# EAGLE design Tapuino 1.2 (EAGLE 7.1.0)
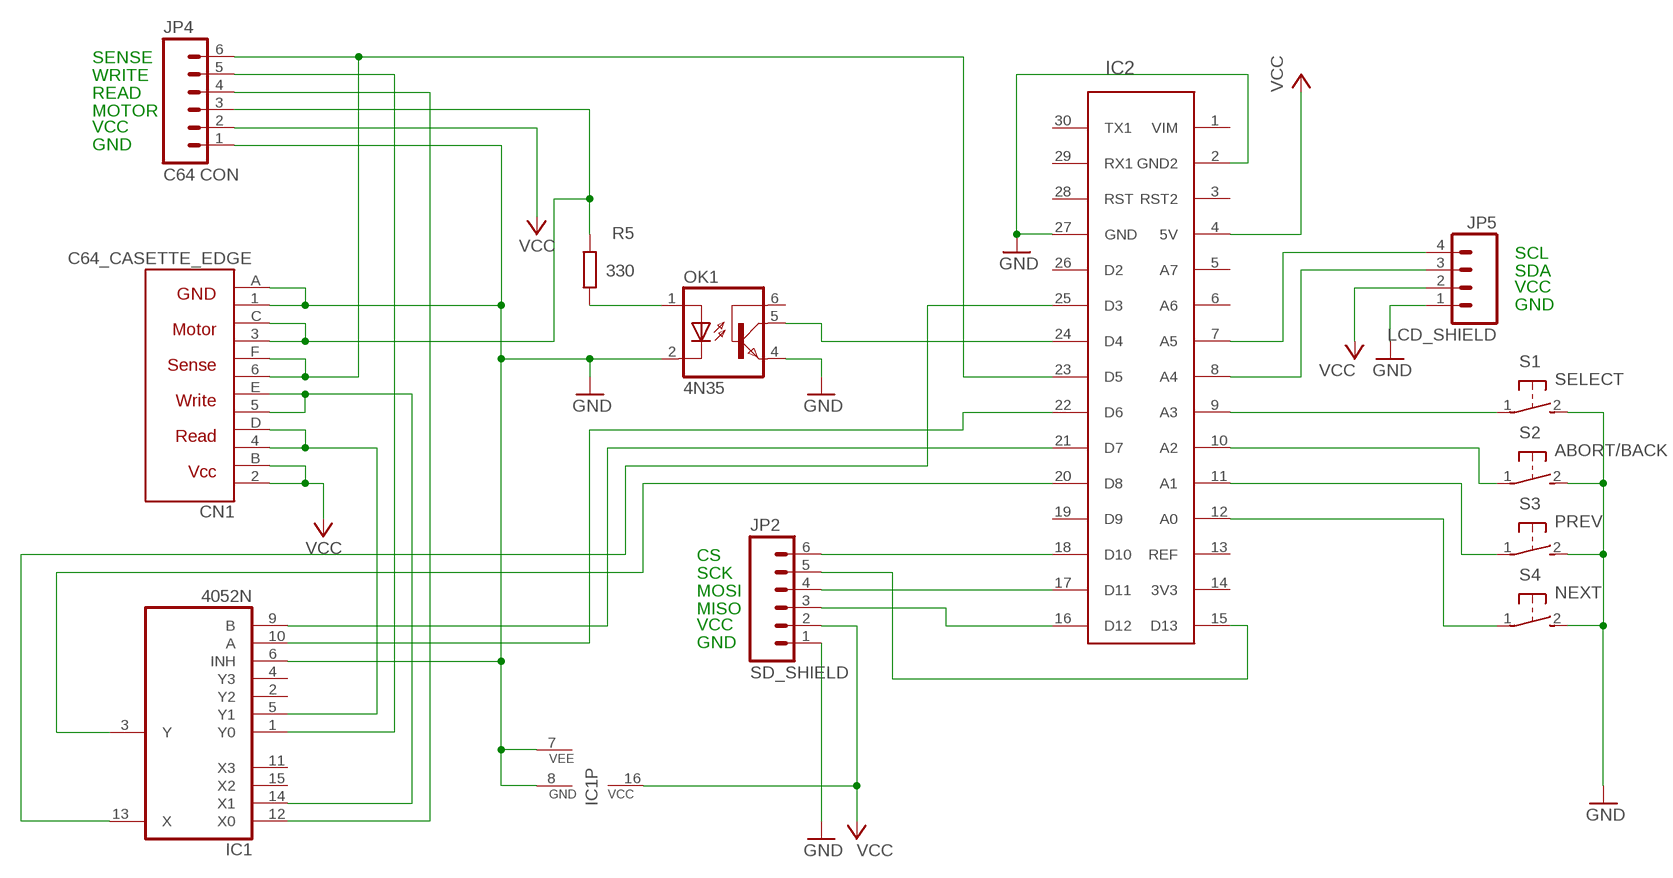
[diagram p0: schematic, sheet 1]

## Parts
CN1  C64_CASETTE_EDGE  [C64_CASSETTE]
IC1  4052N  [DIL16]
IC2  ARDUINO_NANO_V3  [NANO_V3]
JP2  SD_SHIELD  M06LOCK_LONGPADS  [1X06_LOCK_LONGPADS]
JP4  C64 CON  M06LOCK_LONGPADS  [1X06_LOCK_LONGPADS]
JP5  LCD_SHIELD  M04LOCK_LONGPADS  [1X04_LOCK_LONGPADS]
OK1  4N35  [DIL06]
R5  330  R-EU_0207/10  [0207/10]
S1  SELECT  31-XX  [B3F-31XX]
S2  ABORT/BACK  31-XX  [B3F-31XX]
S3  PREV  31-XX  [B3F-31XX]
S4  NEXT  31-XX  [B3F-31XX]

## Nets
GND [GND]: CN1.1(GND1) CN1.A(GND2) IC1.6(INH) IC1.7(VEE) IC1.8(GND) IC2.2(GND2) IC2.27(GND) JP2.1 JP4.1 JP5.1 OK1.2(C) OK1.4(EMI) S1.2(S) S2.2(S) S3.2(S) S4.2(S)
N$1: IC2.16(D12) JP2.3
N$2: IC2.18(D10) JP2.6
N$3: IC2.15(D13) JP2.5
N$4: IC2.17(D11) JP2.4
N$5: IC2.7(A5) JP5.4
N$6: IC2.8(A4) JP5.3
N$7: IC2.9(A3) S1.1(P)
N$8: OK1.1(A) R5.1
N$9: IC2.12(A0) S4.1(P)
N$10: IC2.24(D4) OK1.5(COL)
N$11: IC2.11(A1) S3.1(P)
N$13: IC1.1(Y0) JP4.5
N$14: CN1.3(MOTOR1) CN1.C(MOTOR2) JP4.3 R5.2
N$15: IC1.3(Y) IC2.20(D8)
N$16: IC1.12(X0) JP4.4
N$17: CN1.6(SENSE1) CN1.F(SENSE2) IC2.23(D5) JP4.6
N$18: IC1.13(X) IC2.25(D3)
N$19: CN1.4(READ1) CN1.D(READ2) IC1.5(Y1)
N$20: IC1.9(B) IC2.21(D7)
N$21: CN1.5(WRITE1) CN1.E(WRITE2) IC1.14(X1)
N$22: IC1.10(A) IC2.22(D6)
N$23: IC2.10(A2) S2.1(P)
VCC [VCC]: CN1.2(VCC1) CN1.B(VCC2) IC1.16(VCC) IC2.4(5V) JP2.2 JP4.2 JP5.2
Unconnected: IC1.2(Y2) IC1.4(Y3) IC1.11(X3) IC1.15(X2) IC2.1(VIM) IC2.3(RST2) IC2.5(A7) IC2.6(A6) IC2.13(REF) IC2.14(3V3) IC2.19(D9) IC2.26(D2) IC2.28(RST) IC2.29(RX1) IC2.30(TX1) OK1.6(BAS)

## Notes on the sheet
- SENSE
- WRITE
- READ
- MOTOR
- VCC
- GND
- SCL
- SDA
- VCC
- GND
- CS
- SCK
- MOSI
- MISO
- VCC
- GND

## Library data of the parts
CN1 = commodore:C64_CASETTE_EDGE
IC1 = 40xx:4052: Dual 4-channel ANALOG MULTIPLEXER
IC2 = arduino:ARDUINO_NANO_V3
JP2 JP4 = SparkFun:M06: Header 6 Standard 6-pin 0.1" header. Use with straight break away headers (SKU : PRT-00116), right angle break away headers (PRT-00553), swiss pins (PRT-00743), machine pins (PRT-00117), and female headers (PRT-00115). Molex polarized connector foot print use with SKU : PRT-08094 with associated crimp pins and housings. NOTES ON THE VARIANTS LOCK and LOCK_LONGPADS... This footprint was designed to help hold the alignment of a through-hole component (i.e. 6-pin header) while soldering it into place. You may notice that each hole has been shifted either up or down by 0.005 of an inch from it's more standard position (which is a perfectly straight line). This slight alteration caused the pins (the squares in the middle) to touch the edges of the holes. Because they are alternating, it causes a "brace" to hold the component in place. 0.005 has proven to be the perfect amount of "off-center" position when using our standard breakaway headers. Although looks a little odd when you look at the bare footprint, once you have a header in there, the alteration is very hard to notice. Also, if you push a header all the way into place, it is covered up entirely on the bottom side. This idea of altering the position of holes to aid alignment will be further integrated into the Sparkfun Library for other footprints. It can help hold any component with 3 or more connection pins.
JP5 = SparkFun:M04: Header 4 Standard 4-pin 0.1" header. Use with straight break away headers (SKU : PRT-00116), right angle break away headers (PRT-00553), swiss pins (PRT-00743), machine pins (PRT-00117), and female headers (PRT-00115). Molex polarized connector foot print use with SKU : PRT-08231 with associated crimp pins and housings.
OK1 = optocoupler:4N35: MOTOROLA OPTO COUPLER; MF: FAIRCHILD SEMICONDUCTOR; MPN: 4N35; OC_FARNELL: 1328375; OC_NEWARK: 72K9946
R5 = resistor:R-EU_: RESISTOR, European symbol
S1-S4 = switch-omron:31-XX: OMRON SWITCH; MPN: B3F-3100; OC_FARNELL: 959704; OC_NEWARK: 36M3582

## Net classes
0 default: width 0.254 mm, clearance 0.254 mm
1 GND: width 0.762 mm, clearance 0.381 mm
2 VCC: width 0.762 mm, clearance 0.381 mm

## Board
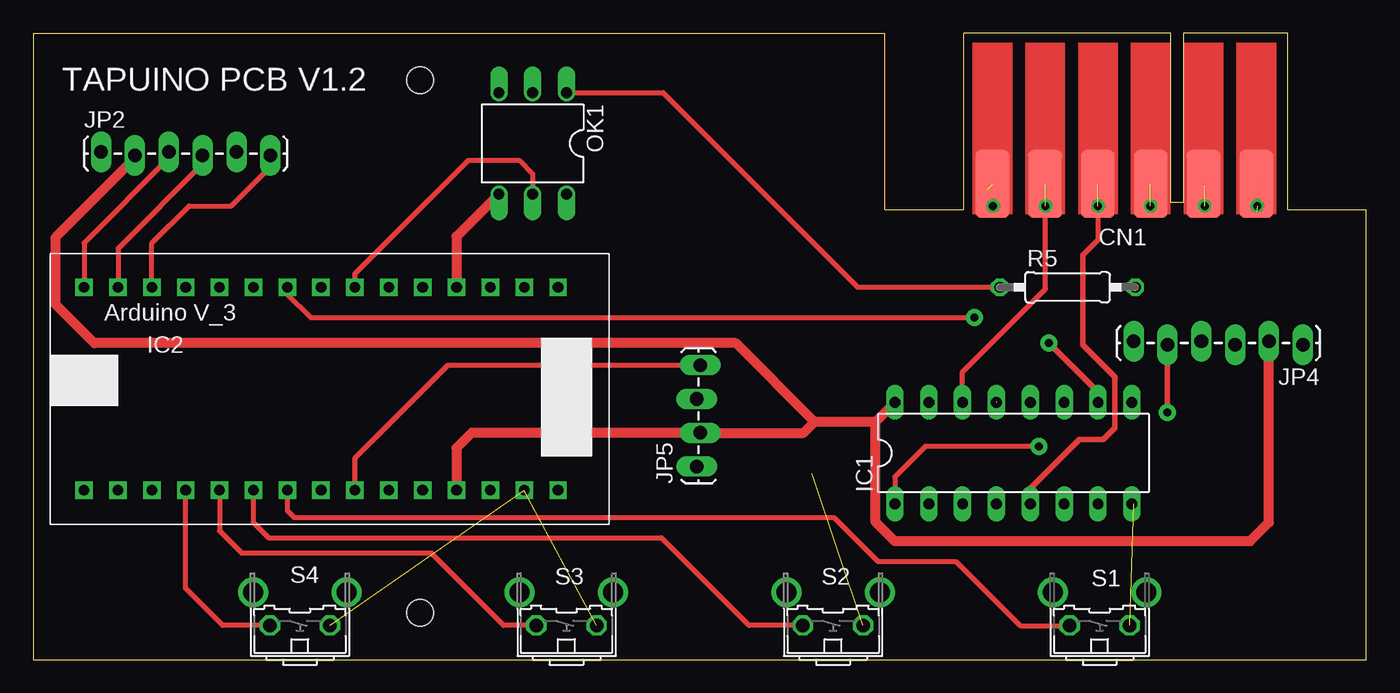
[diagram p1: board, top side]
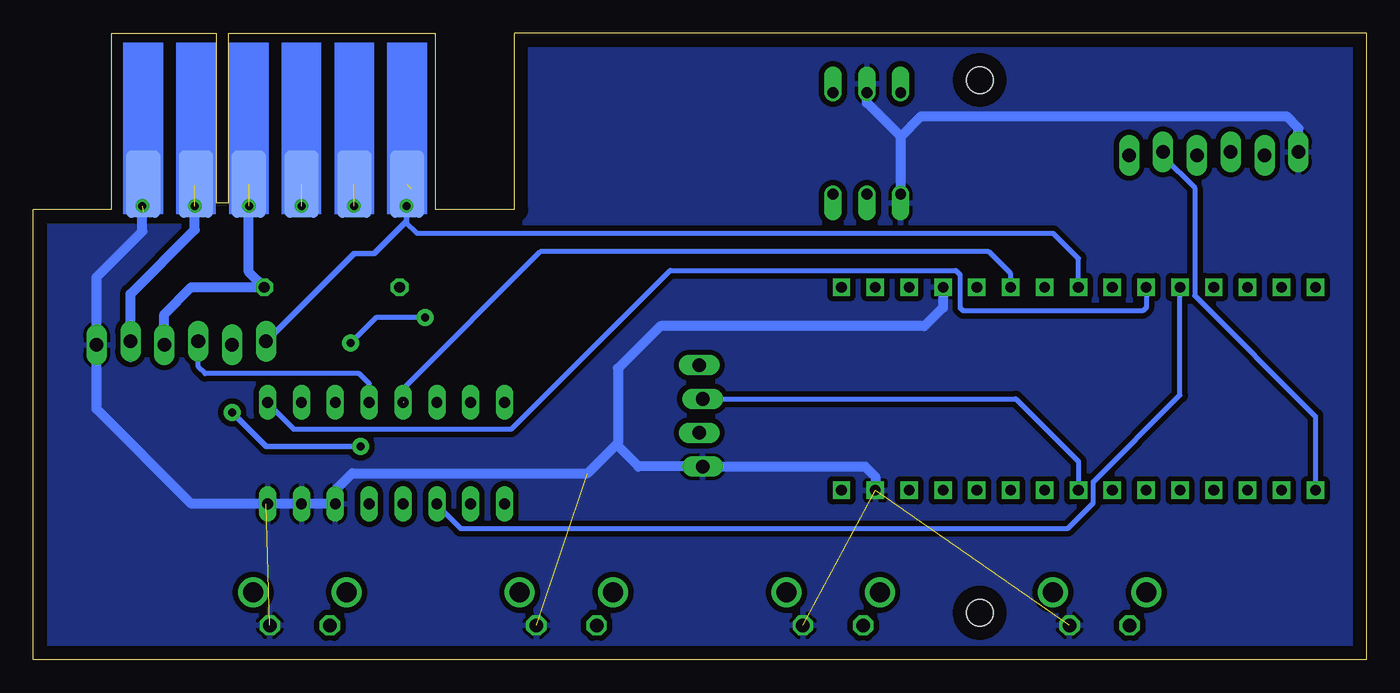
[diagram p2: board, bottom side, seen from below]

Size 100 x 47 mm. Coordinates in mm from the lower left corner, seen from the top.
Outline: 94.11,33.78 100,33.78 100,0 0,0 0,47 63.9,47
Outline: 69.77,33.78 63.88,33.78 63.88,47
Copper layers (1*16): Top 0.035mm / dielectric 1.5mm / Bottom 0.035mm
Design rules "default *": minimum track width 15mil, minimum drill 20mil, track to track 10mil, track to pad 10mil, pad to pad 10mil, via to via 10mil, smd to smd 8mil, copper to edge 40mil, drill to drill 10mil, minimum pad ring 10mil, minimum via ring 8mil, stop-mask expansion 4mil, vias tented up to drill 0mil, thermal gap 10mil
Holes 2 mm at 29,43.5 29,3.5

### Footprints (pad centres in the part's own frame; a part is rotated, then mirrored left to right if it is on the bottom)
C64_CASSETTE = smd 2.54 x 5.08: 1 -21.779,3.68; 2 -17.819,3.68; 3 -13.859,3.68; 4 -9.899,3.68; 5 -5.939,3.68; 6 -1.979,3.68 | smd 2.54 x 5.08 bottom: A -21.779,3.68; B -17.819,3.68; C -13.859,3.68; D -9.899,3.68; E -5.939,3.68; F -1.979,3.68
DIL16 = drill 0.813 long: 1 -8.89,-3.81; 2 -6.35,-3.81; 3 -3.81,-3.81; 4 -1.27,-3.81; 5 1.27,-3.81; 6 3.81,-3.81; 7 6.35,-3.81; 8 8.89,-3.81; 9 8.89,3.81; 10 6.35,3.81; 11 3.81,3.81; 12 1.27,3.81; 13 -1.27,3.81; 14 -3.81,3.81; 15 -6.35,3.81; 16 -8.89,3.81
NANO_V3 = drill 0.8 square: 1 -7.62,1.27; 2 -5.08,1.27; 3 -2.54,1.27; 4 0,1.27; 5 2.54,1.27; 6 5.08,1.27; 7 7.62,1.27; 8 10.16,1.27; 9 12.7,1.27; 10 15.24,1.27; 11 17.78,1.27; 12 20.32,1.27; 13 22.86,1.27; 14 25.4,1.27; 15 27.94,1.27; 16 27.94,-13.97; 17 25.4,-13.97; 18 22.86,-13.97; 19 20.32,-13.97; 20 17.78,-13.97; 21 15.24,-13.97; 22 12.7,-13.97; 23 10.16,-13.97; 24 7.62,-13.97; 25 5.08,-13.97; 26 2.54,-13.97; 27 0,-13.97; 28 -2.54,-13.97; 29 -5.08,-13.97; 30 -7.62,-13.97
1X06_LOCK_LONGPADS = drill 1.016 long: 1 0,0; 2 2.54,-0.254; 3 5.08,0; 4 7.62,-0.254; 5 10.16,0; 6 12.7,-0.254
1X04_LOCK_LONGPADS = drill 1.016 long: 1 0,0; 2 2.54,-0.254; 3 5.08,0; 4 7.62,-0.254
DIL06 = drill 0.813 offset: 1 -2.54,-3.81; 2 0,-3.81; 3 2.54,-3.81; 4 2.54,3.81; 5 0,3.81; 6 -2.54,3.81
0207/10 = drill 0.813 octagon: 1 -5.08,0; 2 5.08,0
B3F-31XX = drill 1.016 octagon: 1 -2.261,-1.245; 2 2.261,-1.245 | drill 1.499 pad 2.159: 3 -3.505,1.245; 4 3.505,1.245

### Placement (x,y rotation side)
CN1  69.98,39.37 180 top
IC1  73.53,15.49 0 top
IC2  31.75,13.97 180 top
JP2  5.08,38.1 0 top
JP4  95.25,23.62 180 top
JP5  49.78,14.48 90 top
OK1  37.47,38.73 180 top
R5  77.6,27.94 0 top
S1  80,3.81 0 top
S2  60,3.81 0 top
S3  40,3.81 0 top
S4  20,3.81 0 top

### Tracks (layer width: path | path; a pad name or v marks a point on that pad's centre or on a via)
GND  (via drill 0.6)  (6 unrouted)
  Top 0.762: IC2.27 31.75,31.75 OK1.4
  Bottom 0.762: JP2.1 5.08,39.88 5.97,40.77 33.4,40.77 34.92,39.24 | IC2.2 36.83,13.72 37.59,14.48 JP5.1 54.61,14.48 56.26,16.13 | IC2.27 31.75,26.42 33.15,25.02 52.96,25.02 56.13,21.84 56.13,16.26 56.26,16.13 | 56.26,16.13 58.42,13.97 76.07,13.97 77.34,12.7 IC1.6 IC1.7 80.01,11.75 80.01,11.68 IC1.8 82.55,11.75 82.55,11.68 88.14,11.68 95.25,18.8 JP4.1 95.25,28.7 91.82,32.13 91.82,33.53 91.76,33.59 | OK1.4 34.92,39.24 | 34.92,39.24 37.47,41.78 OK1.2
  Bottom 0.813: CN1.A 91.76,33.59 | 82.55,11.68 IC1.8 | 80.01,11.68 IC1.7
  other vias: 91.82,34.04
  pour Bottom (isolate 0.406): 0.64,45.97 63.12,45.97 63.12,32.51 99.06,32.51 99.06,1.02 0.64,1.02
N$1
  Top 0.381: IC2.16 3.81,31.27 10.16,37.62 JP2.3
N$2
  Top 0.381: IC2.18 8.89,31.24 11.68,34.04 14.86,34.04 17.78,36.96 JP2.6
N$3
  Bottom 0.381: JP2.5 15.24,37.78 12.86,35.4 12.86,27.3 3.81,18.26 IC2.15
N$4
  Top 0.381: JP2.4 12.7,37.21 6.35,30.86 IC2.17
N$5
  Top 0.381: IC2.7 24.13,15.11 31.11,22.1 JP5.4
N$6
  Bottom 0.381: JP5.3 26.29,19.56 21.59,14.86 IC2.8
N$7
  Top 0.381: IC2.9 19.05,11.18 19.56,10.67 60.07,10.67 63.37,7.37 69.22,7.37 74.04,2.54 77.71,2.54 S1.1
N$8
  Top 0.381: OK1.1 47.24,42.55 61.85,27.94 R5.1
N$9
  Top 0.381: IC2.12 11.43,5.33 14.2,2.56 S4.1
N$10
  Top 0.381: IC2.24 24.13,28.96 32.64,37.47 36.45,37.47 37.47,36.45 OK1.5
N$11
  Top 0.381: IC2.11 13.97,9.65 15.62,8 29.84,8 35.28,2.56 S3.1
N$13  (via drill 0.6 pad 1.27)
  Top 0.381: v75.44,16 66.93,16 64.64,13.72 IC1.1
  Top 0.406: v85.09,18.54 JP4.5
  Bottom 0.406: v75.44,16 82.55,16 v85.09,18.54
N$14  (via drill 0.6)  (2 unrouted)
  Bottom 0.762: JP4.3 90.17,25.91 88.14,27.94 R5.2 83.84,29.1 CN1.C 83.82,35.67
  other vias: 83.82,34.04
N$15
  Bottom 0.381: IC2.20 13.97,19.84 20.48,13.34 20.48,11.75 22.38,9.84 67.94,9.84 69.69,11.59 IC1.3
N$16
  Bottom 0.381: JP4.4 87.63,21.97 87.12,21.46 75.56,21.46 74.8,20.7 IC1.12
N$17  (via drill 0.6)  (2 unrouted)
  Bottom 0.381: IC2.23 21.59,30.1 23.5,32 71.22,32 72.06,32.84
  Bottom 0.406: CN1.F 71.96,35.63 | 71.63,35.31 72.01,34.92 v72.01,34.04 72.01,32.89 72.06,32.84 74.42,30.48 75.95,30.48 JP4.6
N$18  (1 unrouted)
  Bottom 0.381: IC2.25 26.67,28.96 28.32,30.61 61.98,30.61 72.23,20.35 72.23,19.37
N$19  (via drill 0.6)  (2 unrouted)
  Top 0.381: CN1.D 79.88,31.49 78.74,30.35
  Top 0.406: IC1.5 74.8,12.83 78.49,16.51 80.26,16.51 81.15,17.4 81.15,21.21 78.74,23.62 78.74,30.35
  other vias: 79.88,34.04
N$20
  Bottom 0.381: IC1.9 82.39,19.21 80.49,17.3 64.14,17.3 52.23,29.21 30.8,29.21 30.48,28.89 30.48,26.42 30.23,26.16 16.76,26.16 16.51,26.42 IC2.21
N$21  (via drill 0.6)  (2 unrouted)
  Top 0.381: IC1.14 69.72,21.59 75.95,27.81 75.95,35.66 CN1.5
  other vias: 75.95,34.04
N$22  (via drill 0.6 pad 1.27)
  Top 0.381: 79.85,19.37 IC1.10 | IC2.22 19.05,27.43 20.83,25.65 v70.61,25.65
  Top 0.406: 79.85,19.37 79.85,20.1 v76.2,23.75
  Bottom 0.381: v70.61,25.65 74.3,25.65 v76.2,23.75
N$23
  Top 0.381: IC2.10 16.51,10.29 17.65,9.14 47.12,9.14 53.7,2.56 S2.1
VCC  (via drill 0.6)  (2 unrouted)
  Top 0.762: 64.61,19.21 IC1.16 63.18,17.84 | JP4.2 92.71,10.29 91.31,8.89 64.61,8.89 63.18,10.32 63.18,17.84 | JP2.2 7.62,37.62 1.65,31.66 1.65,26.67 4.57,23.75 52.7,23.75 58.61,17.84 | 63.18,17.84 58.61,17.84 | 58.61,17.84 57.78,17.02 JP5.2 32.89,17.02 31.75,15.88 IC2.4
  Bottom 0.762: JP4.2 92.71,27.43 87.88,32.26 87.88,35.6 CN1.2
  Bottom 0.813: JP4.2 92.71,22.73
  other vias: 87.88,34.04

### Text on the board
tNames: TAPUINO PCB V1.2